# EAGLE design RLC Demonstration (EAGLE 9.6.2)
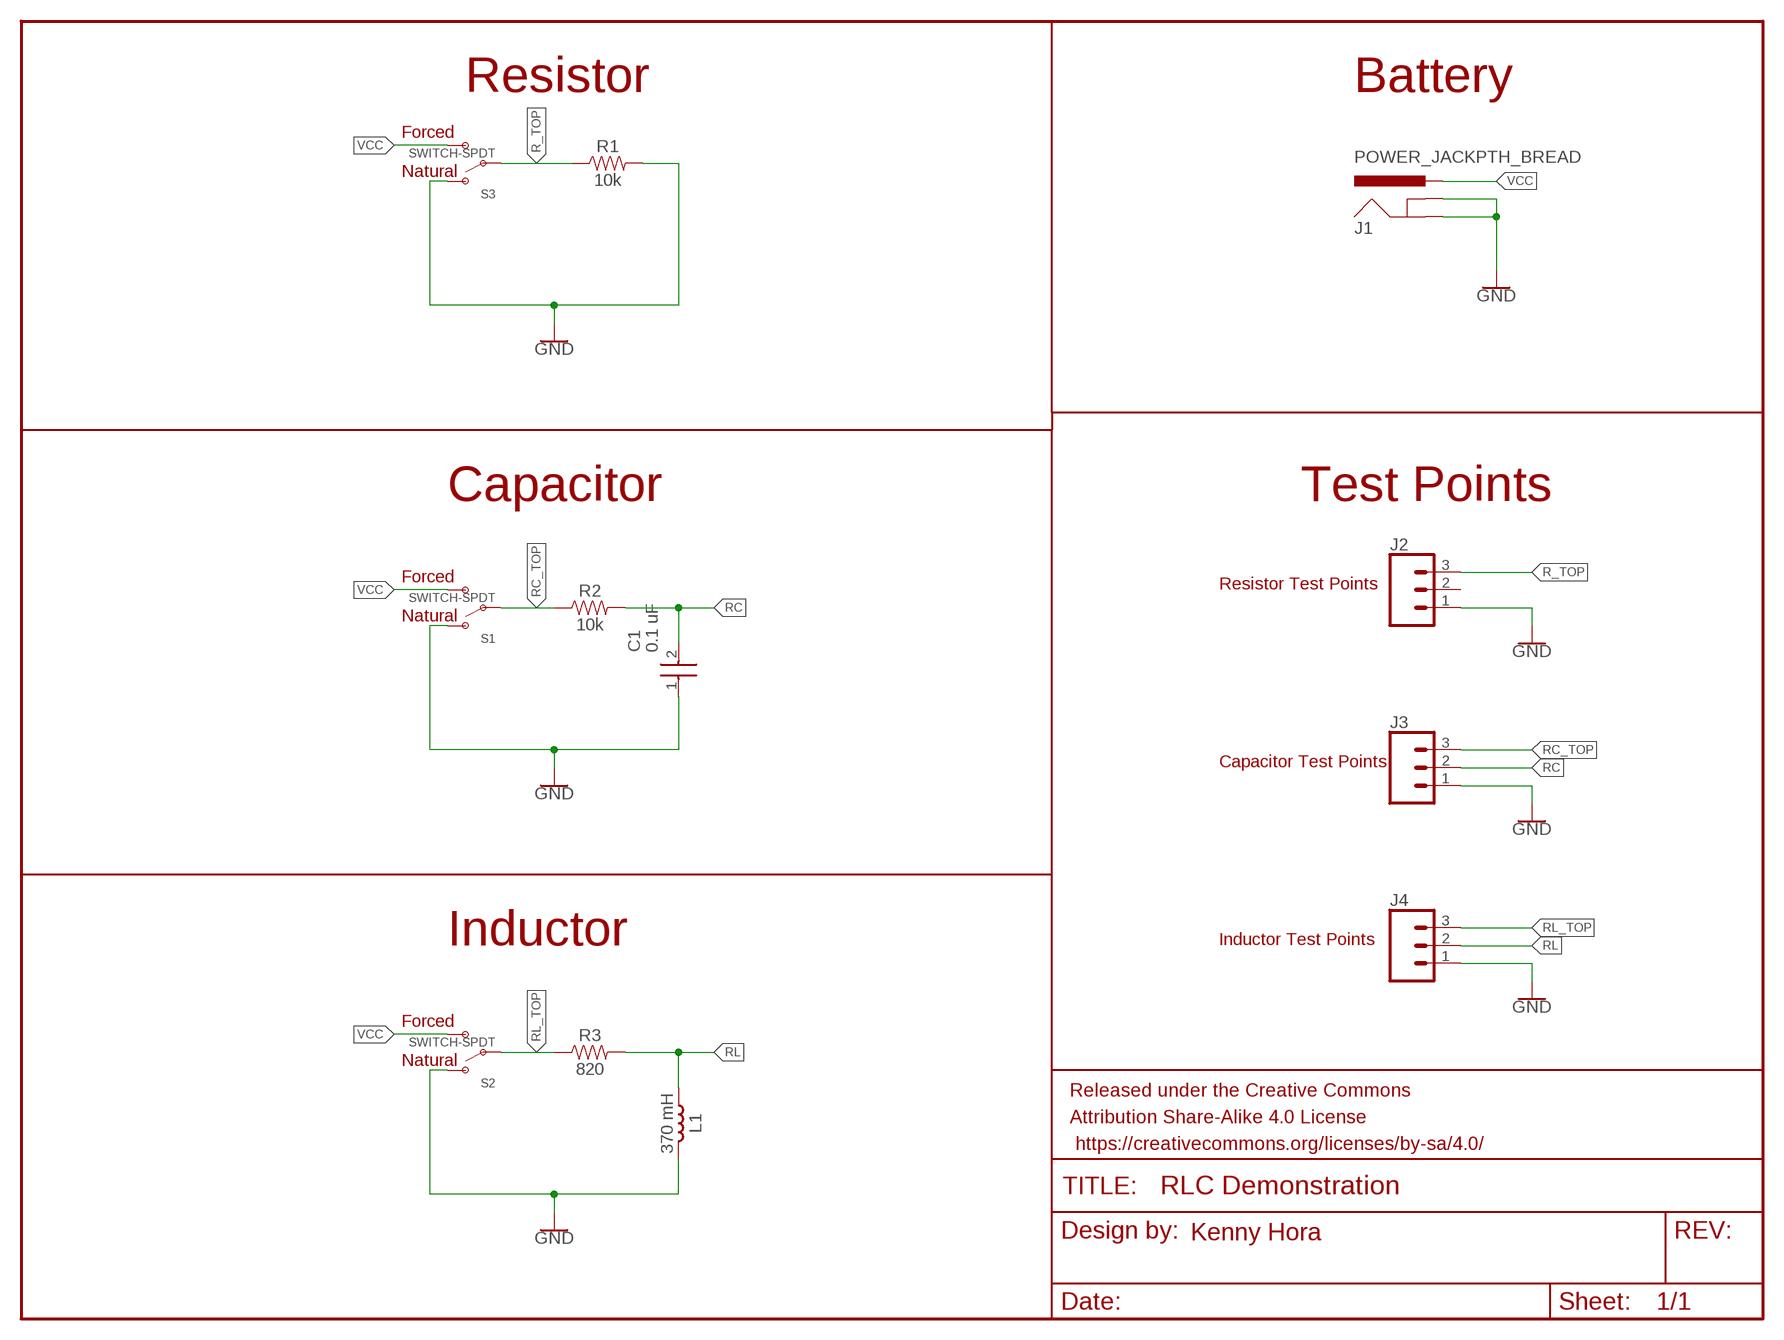
[diagram p0: schematic, sheet 1]

## Parts
C1  0.1 uF  K104K15X7RF53H5  [K104K15X7RF53H5]
FRAME1  FRAME-LETTERNO_PACKAGE  [DUMMY]
J1  POWER_JACKPTH_BREAD  [POWER_JACK_PTH_BREAD]
J2  CONN_03LOCK  [1X03_LOCK]
J3  CONN_03LOCK  [1X03_LOCK]
J4  CONN_03LOCK  [1X03_LOCK]
L1  370 mH  KNOWLES-370MH-5100-253441  [KNOWLES-5100-253441]
R1  10k  10KOHM-HORIZ-1/4W-5%  [AXIAL-0.3]
R2  10k  10KOHM-HORIZ-1/4W-5%  [AXIAL-0.3]
R3  820  10KOHM-HORIZ-1/4W-5%  [AXIAL-0.3]
S1  SWITCH-SPDT  [OS102011MA1QN1]
S2  SWITCH-SPDT  [OS102011MA1QN1]
S3  SWITCH-SPDT  [OS102011MA1QN1]

## Nets
GND: C1.1 J1.GND J1.GNDBREAK J2.1 J3.1 J4.1 L1.P$1 R1.P$2 S1.P$2 S2.P$2 S3.P$2
R_TOP: J2.3 R1.P$1 S3.P$1
RC: C1.2 J3.2 R2.P$2
RC_TOP: J3.3 R2.P$1 S1.P$1
RL: J4.2 L1.P$2 R3.P$2
RL_TOP: J4.3 R3.P$1 S2.P$1
VCC: J1.PWR S1.P$3 S2.P$3 S3.P$3
Unconnected: J2.2

## Notes on the sheet
- Resistor | Battery
- Forced
- Natural
- Capacitor | Test Points
- Forced
- Resistor Test Points
- Natural
- Capacitor Test Points
- Inductor | Inductor Test Points
- Forced
- Natural
- Kenny Hora

## Library data of the parts
C1 = SamacSys_Parts:K104K15X7RF53H5: Vishay 100nF Multilayer Ceramic Capacitor MLCC 50V dc +/-10% Through Hole K104K15X7RF53H5 Source: Datasheet <http://www.vishay.com/docs/45171/kseries.pdf>; ARROW_PART_NUMBER: K104K15X7RF53H5; ARROW_PRICE-STOCK: https://www.arrow.com/en/products/k104k15x7rf53h5/vishay; DESCRIPTION: Vishay 100nF Multilayer Ceramic Capacitor MLCC 50V dc +/-10% Through Hole K104K15X7RF53H5; HEIGHT: mm; MANUFACTURER_NAME: Vishay; MANUFACTURER_PART_NUMBER: K104K15X7RF53H5; MOUSER_PART_NUMBER: 594-K104K15X7RF53H5; MOUSER_PRICE-STOCK: https://www.mouser.co.uk/ProductDetail/Vishay-BC-Components/K104K15X7RF53H5?qs=sYfpZ29HcUSlgH5bSUHkYw%3D%3D
FRAME1 = SparkFun-Aesthetics:FRAME-LETTER: Schematic Frame - Letter Standard 8.5x11 US Letter frame; DESIGNER: Nobody; VERSION: v01
J1 = SparkFun-Connectors:POWER_JACK: Power Jack Connector This is the standard 5.5mm barrel jack for power. The PTH is the most common, proven, reliable, footprint. The Slot footprint only works if the mill layer is transmitted to the PCB fab house so be warned. Here are the connectors we sell at SparkFun: DC Barrel Power Jack/Connector <https://www.sparkfun.com/products/119> (PRT-00119) DC Barrel Power Jack/Connector (SMD) <https://www.sparkfun.com/products/12748> (PRT-12748) DC Barrel Jack Adapter - Breadboard Compatible <https://www.sparkfun.com/products/10811> (PRT-10811) It is used on this SparkFun product (and many, many others): SparkFun RedBoard - Programmed with Arduino <https://www.sparkfun.com/products/12757> (DEV-12757) Also, if you need a mating power supply or connector, please check these out: Wall Adapter Power Supply - 9VDC 650mA <https://www.sparkfun.com/products/298> (TOL-00298) DC Barrel Jack Adapter - Male <https://www.sparkfun.com/products/10287> (PRT-10287); PROD_ID: COMP-13253
J2-J4 = SparkFun-Connectors:CONN_03: Multi connection point. Often used as Generic Header-pin footprint for 0.1 inch spaced/style header connections On any of the 0.1 inch spaced packages, you can populate with these: Break Away Headers - Straight <https://www.sparkfun.com/products/116> (PRT-00116) Break Away Male Headers - Right Angle <https://www.sparkfun.com/products/553> (PRT-00553) Female Headers <https://www.sparkfun.com/products/115> (PRT-00115) Break Away Headers - Machine Pin <https://www.sparkfun.com/products/117> (PRT-00117) Break Away Female Headers - Swiss Machine Pin <https://www.sparkfun.com/products/743> (PRT-00743) Stackable Header - 3 Pin (Female, 0.1") <https://www.sparkfun.com/products/13875> (PRT-13875) For SCREWTERMINALS and SPRING TERMINALS visit here: Screw Terimnals on SparkFun.com <https://www.sparkfun.com/search/results?term=Screw+Terminals> (5mm/3.5mm/2.54mm spacing) This device is also useful as a general connection point to wire up your design to another part of your project. Our various solder wires solder well into these plated through hole pads. Hook-Up Wire - Assortment (Stranded, 22 AWG) <https://www.sparkfun.com/products/11375> (PRT-11375) Hook-Up Wire - Assortment (Solid Core, 22 AWG) <https://www.sparkfun.com/products/11367> (PRT-11367) View the entire wire category on our website here <https://www.sparkfun.com/categories/141> Special notes: Molex polarized connector foot print use with SKU : PRT-08232 with associated crimp pins and housings.
L1 = Kenny-Custom:KNOWLES-370MH-5100-253441: Knowles 370 mH Inductor
R1 R2 = SparkFun-Resistors:10KOHM: 10kΩ resistor A resistor is a passive two-terminal electrical component that implements electrical resistance as a circuit element. Resistors act to reduce current flow, and, at the same time, act to lower voltage levels within circuits. - Wikipedia; PROD_ID: RES-09435
R3 = SparkFun-Resistors:10KOHM: 10kΩ resistor A resistor is a passive two-terminal electrical component that implements electrical resistance as a circuit element. Resistors act to reduce current flow, and, at the same time, act to lower voltage levels within circuits. - Wikipedia; PROD_ID: RES-09435; VALUE: 10k
S1-S3 = Kenny-Custom:SWITCH-SPDT

## Board
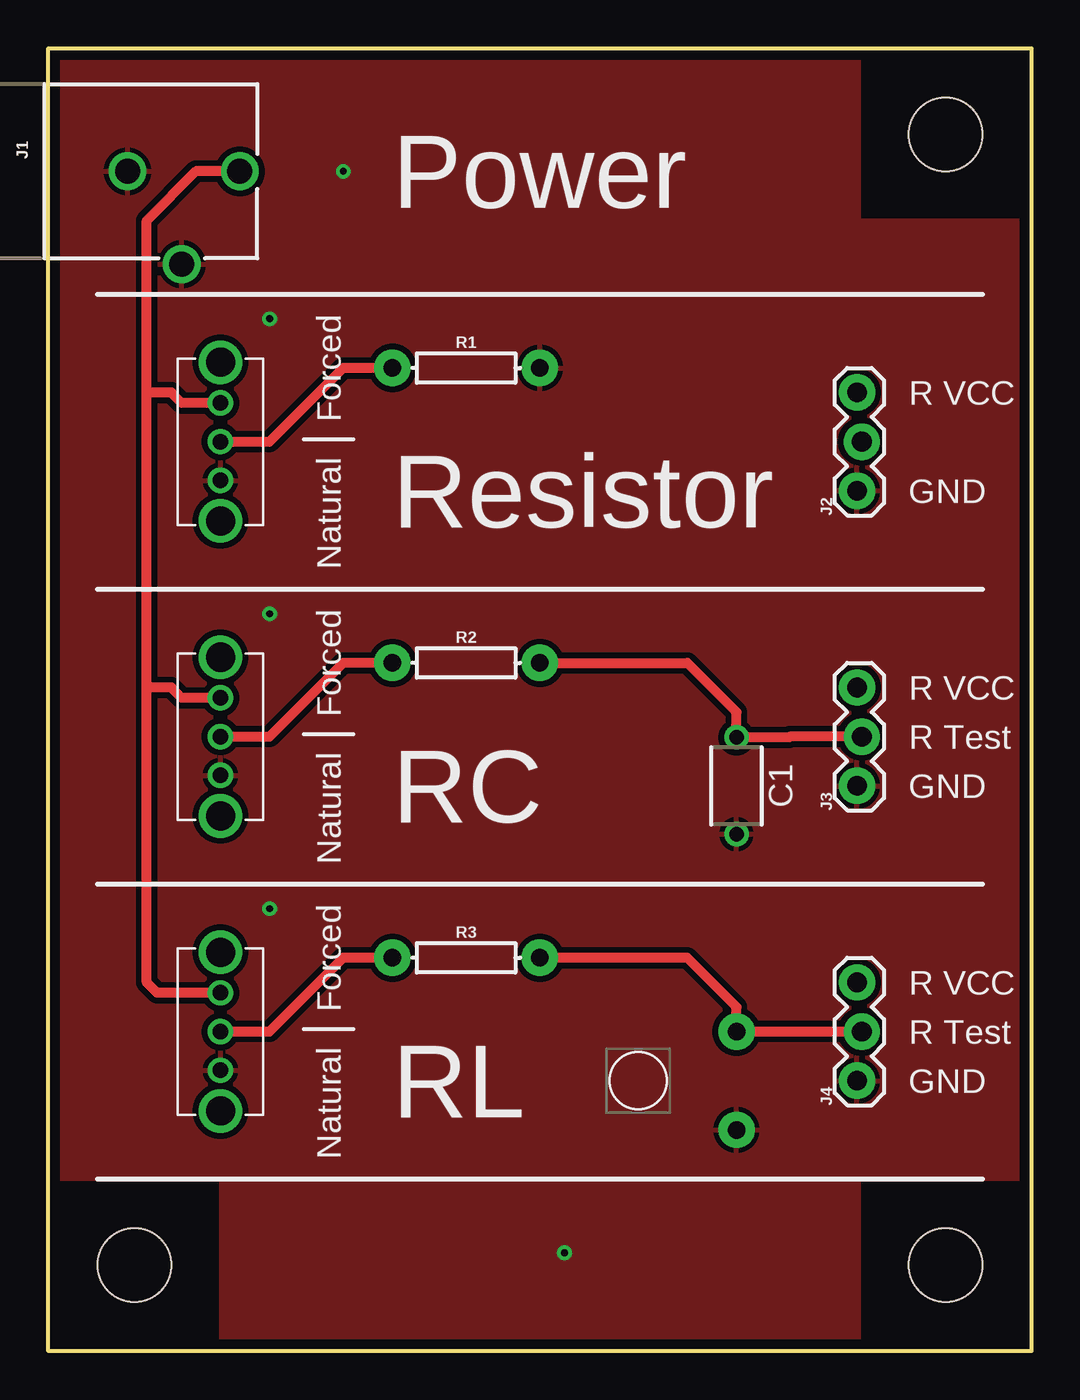
[diagram p1: board, top side]
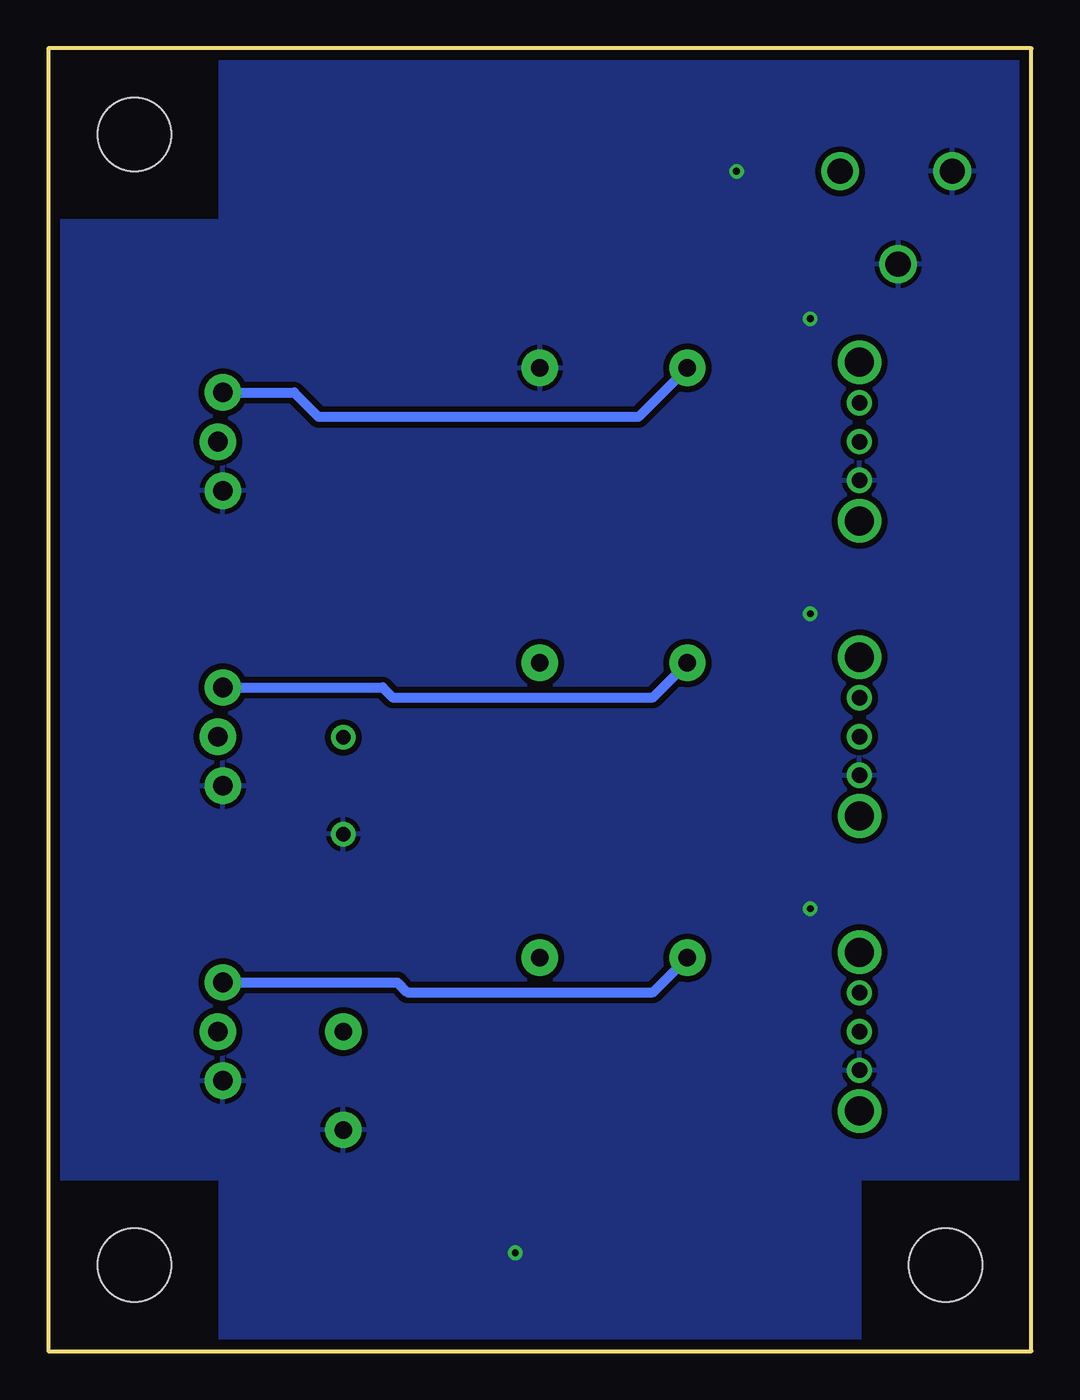
[diagram p2: board, bottom side, seen from below]

Size 50.8 x 67.31 mm. Coordinates in mm from the lower left corner, seen from the top.
Outline: 0,0 0,67.31 50.8,67.31 50.8,0 0,0
Copper layers (1*16): Top 0.035mm / dielectric 1.5mm / Bottom 0.035mm
Design rules "default *": minimum track width 6mil, minimum drill 0.35mm, track to track 6mil, track to pad 6mil, pad to pad 6mil, via to via 6mil, smd to smd 6mil, copper to edge 20mil, drill to drill 6mil, minimum pad ring 10mil, minimum via ring 8mil, stop-mask expansion 4mil, vias tented up to drill 0mil, thermal gap 10mil
Holes 3.8 mm at 46.35,62.87 4.45,4.45 46.35,4.45

### Footprints (pad centres in the part's own frame; a part is rotated, then mirrored left to right if it is on the bottom)
K104K15X7RF53H5 = drill 0.75 pad 1.25: 1 -2.5,0; 2 2.5,0
POWER_JACK_PTH_BREAD = drill 1.3: GND 0,7.9; GNDBREAK 4.8,10.7; PWR 0,13.7
1X03_LOCK = drill 1.016 pad 1.88: 1 0,0.127; 2 2.54,-0.127; 3 5.08,0.127
KNOWLES-5100-253441 = drill 0.9 pad 1.88: P$1 -2.54,0; P$2 2.54,0
AXIAL-0.3 = drill 0.9 pad 1.88: P$1 -3.81,0; P$2 3.81,0
OS102011MA1QN1 = drill 0.8: P$1 0,0; P$2 -2,0; P$3 2,0 | drill 1.5: P$4 -4.1,0; P$5 4.1,0

### Placement (x,y rotation side)
C1  35.56,29.21 90 top
FRAME1  0,0 0 top
J1  -3.81,60.96 270 top
J2  41.91,44.45 90 top
J3  41.91,29.21 90 top
J4  41.91,13.97 90 top
L1  35.56,13.97 90 top
R1  21.59,50.8 0 top
R2  21.59,35.56 0 top
R3  21.59,20.32 0 top
S1  8.89,31.75 90 top
S2  8.89,16.51 90 top
S3  8.89,46.99 90 top

### Tracks (layer width: path | path; a pad name or v marks a point on that pad's centre or on a via)
GND  (via drill 0.35)
  other vias: 11.43,22.86 11.43,38.1 11.43,53.34 26.67,5.08 15.24,60.96
  pour Top (isolate 0.305): 0,8.89 8.89,8.89 8.89,0 41.91,0 41.91,8.89 50.8,8.89 50.8,58.42 41.91,58.42 41.91,67.31 0,67.31
  pour Bottom (isolate 0.305): 0,8.89 8.89,8.89 8.89,0 41.91,0 41.91,8.89 50.8,8.89 50.8,58.42 41.91,58.42 41.91,67.31 0,67.31
R_TOP
  Top 0.508: S3.P$1 11.43,46.99 15.24,50.8 R1.P$1
  Bottom 0.508: R1.P$1 20.32,48.26 36.83,48.26 38.1,49.53 J2.3
RC
  Top 0.508: R2.P$2 33.02,35.56 35.56,33.02 C1.2 38.27,31.71 38.31,31.75 J3.2
RC_TOP
  Top 0.508: S1.P$1 11.43,31.75 15.24,35.56 R2.P$1
  Bottom 0.508: R2.P$1 19.56,33.78 33.02,33.78 33.53,34.29 J3.3
RL
  Top 0.508: R3.P$2 33.02,20.32 35.56,17.78 L1.P$2 J4.2
RL_TOP
  Top 0.508: S2.P$1 11.43,16.51 15.24,20.32 R3.P$1
  Bottom 0.508: R3.P$1 19.56,18.54 32.26,18.54 32.77,19.05 J4.3
VCC
  Top 0.508: S2.P$3 5.62,18.51 5.08,19.05 5.08,34.29 | 5.08,34.29 5.08,49.53 | 5.08,49.53 5.08,58.42 7.62,60.96 J1.PWR | S3.P$3 6.89,48.99 6.35,49.53 5.08,49.53 | S1.P$3 6.89,33.75 6.35,34.29 5.08,34.29

### Text on the board
tPlace: Power | R VCC | Forced | Resistor | GND | Natural | R VCC | Forced | R Test | RC | GND | Natural | R VCC | Forced | R Test | RL | GND | Natural